# EAGLE design regler (EAGLE 7.5.0)
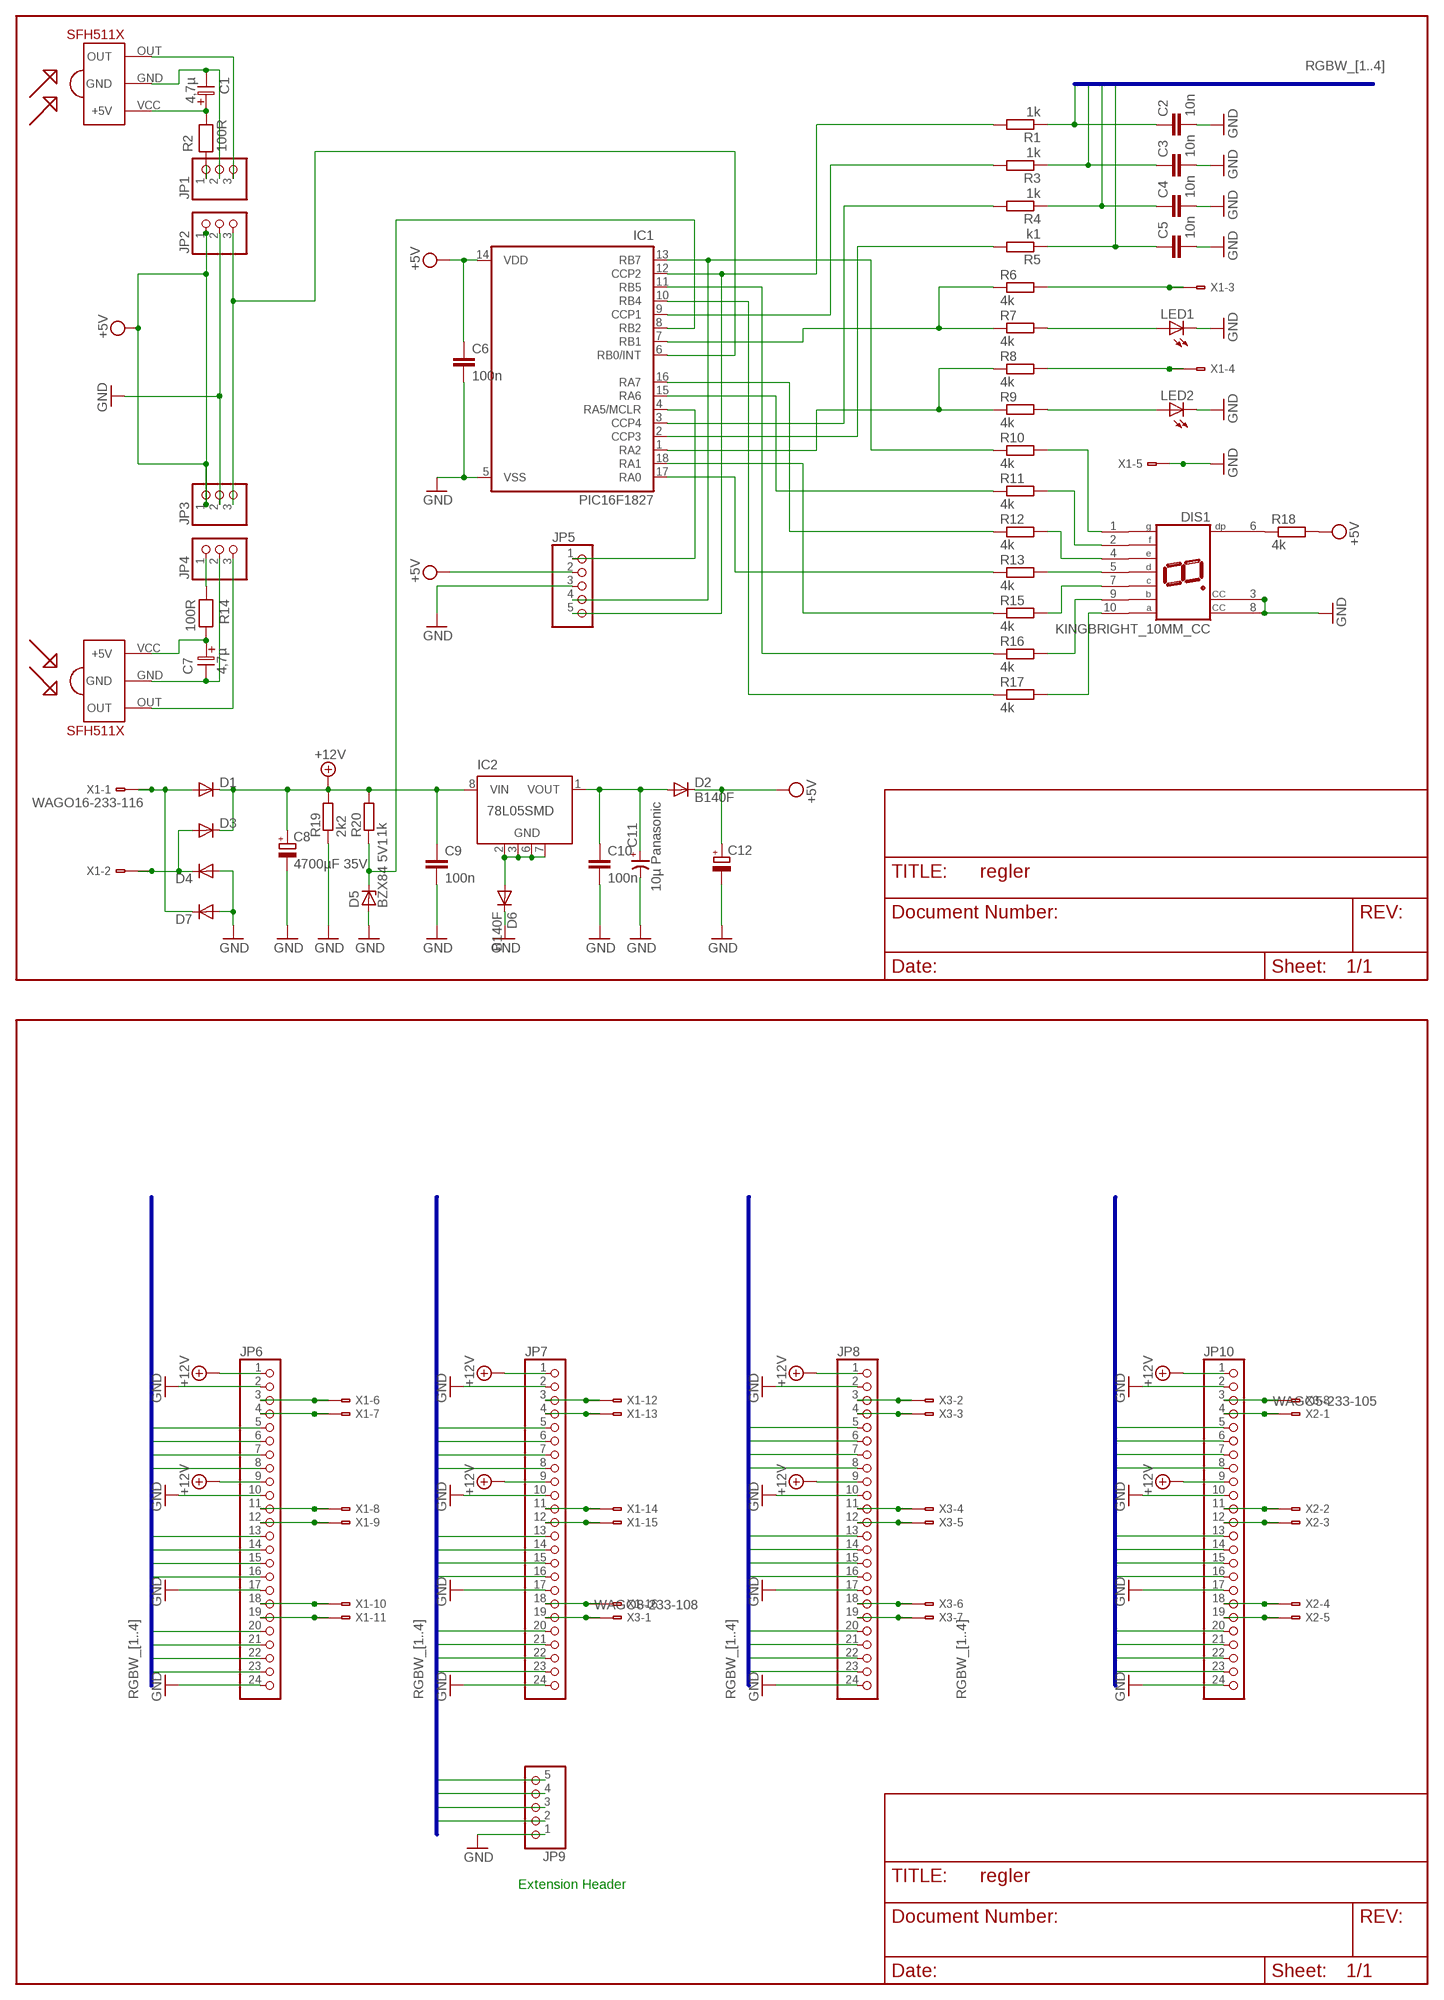
[diagram p0: schematic, sheet 1]

## Parts
C1  4,7µ  ELC-2,5  [ES-2,5]
C2  10n  C-EUC1206K  [C1206K]
C3  10n  C-EUC1206K  [C1206K]
C4  10n  C-EUC1206K  [C1206K]
C5  10n  C-EUC1206K  [C1206K]
C6  100n  C-EUC1206K  [C1206K]
C7  4,7µ  ELC-2,5  [ES-2,5]
C8  4700µF 35V  CPOL-EUE7.5-18  [E7,5-18]
C9  100n  C-EUC1206K  [C1206K]
C10  100n  C-EUC1206K  [C1206K]
C11  10µ Panasonic  CP-SV-B  [SV-B]
C12  CPOL-EUE5-5  [E5-5]
D1  DIODE-SMC  [SMC]
D2  B140F  DIODE-  [DO214AA]
D3  DIODE-SMC  [SMC]
D4  DIODE-SMC  [SMC]
D5  BZX84 5V1  BZX84CSMD  [TO236]
D6  B140F  DIODE-  [DO214AA]
D7  DIODE-SMC  [SMC]
DIS1  KINGBRIGHT_10MM_CC  [HDSP-E]
IC1  PIC16F1827  PIC16F1827_RGB_CONTROLLER7SO  [SO-18W]
IC2  78L05SMD  [SO08]
IR-RECEIVERS1  SFH511XB  [SFH5110]
IR-RECEIVERS2  SFH511XB  [SFH5110]
JP1  PINHD-1X3_2.54  [1X03]
JP2  PINHD-1X3_2.54-SMD  [1X03SMD]
JP3  PINHD-1X3_2.54-SMD  [1X03SMD]
JP4  PINHD-1X3_2.54  [1X03]
JP5  PINHD-1X5_2.54-SMD  [1X05SMD]
JP6  PINHD-1X24_2.54-SMD  [1X24SMD]
JP7  PINHD-1X24_2.54-SMD  [1X24SMD]
JP8  PINHD-1X24_2.54-SMD  [1X24SMD]
JP9  PINHD-1X5_2.54-SMD-90°  [1X05SMD/90]
JP10  PINHD-1X24_2.54-SMD  [1X24SMD]
LED1  LEDCHIPLED_1206  [CHIPLED_1206]
LED2  LEDCHIPLED_1206  [CHIPLED_1206]
R1  1k  R-EU_R1210W  [R1210W]
R2  100R  RESEU-10  [R-10]
R3  1k  R-EU_R1210W  [R1210W]
R4  1k  R-EU_R1210W  [R1210W]
R5  k1  R-EU_R1210W  [R1210W]
R6  4k  R-EU_R0805W  [R0805W]
R7  4k  R-EU_R0805W  [R0805W]
R8  4k  R-EU_R0805W  [R0805W]
R9  4k  R-EU_R0805W  [R0805W]
R10  4k  R-EU_R0805W  [R0805W]
R11  4k  R-EU_R0805W  [R0805W]
R12  4k  R-EU_R0805W  [R0805W]
R13  4k  R-EU_R0805W  [R0805W]
R14  100R  RESEU-10  [R-10]
R15  4k  R-EU_R0805W  [R0805W]
R16  4k  R-EU_R0805W  [R0805W]
R17  4k  R-EU_R0805W  [R0805W]
R18  4k  R-EU_R0805W  [R0805W]
R19  2k2  R-EU_R1210W  [R1210W]
R20  1k  R-EU_R1210W  [R1210W]
X1  WAGO16-233-116  [233-116]
X2  WAGO5-233-105  [233-105]
X3  WAGO8-233-108  [233-108]

## Nets
+12V: C8.+ C9.1 D1.C D3.C IC2.8(VIN) JP6.1 JP6.9 JP7.1 JP7.9 JP8.1 JP8.9 JP10.1 JP10.9 R19.2 R20.2
ABC: IC1.12(CCP2) JP5.5 R1.2
DEF: IC1.9(CCP1) R3.2
GHI: IC1.3(CCP4) R4.2
GND: C1.2 C2.2 C3.2 C4.2 C5.2 C6.2 C7.2 C8.- C9.2 C10.2 C11.- C12.- D4.A D5.A D6.C D7.A DIS1.3(CC) DIS1.8(CC) IC1.5(VSS) IR-RECEIVERS1.GND IR-RECEIVERS2.GND JP1.2 JP2.2 JP3.2 JP4.2 JP5.3 JP6.2 JP6.10 JP6.17 JP6.24 JP7.2 JP7.10 JP7.17 JP7.24 JP8.2 JP8.10 JP8.17 JP8.24 JP9.1 JP10.2 JP10.10 JP10.17 JP10.24 LED1.C LED2.C R19.1 X1.A5(-5:A1) X1.B5(-5:B1)
JKL: IC1.2(CCP3) R5.2
N$1: D1.A D7.C X1.A1(-1:A1) X1.B1(-1:B1)
N$2: D3.A D4.C X1.A2(-2:A1) X1.B2(-2:B1)
N$3: JP6.3 X1.A6(-6:A1) X1.B6(-6:B1)
N$4: D6.A IC2.2(GND) IC2.3(GND) IC2.6(GND) IC2.7(GND)
N$5: C10.1 C11.+ D2.A IC2.1(VOUT)
N$6: D5.C IC1.8(RB2) R20.1
N$7: JP6.4 X1.A7(-7:A1) X1.B7(-7:B1)
N$8: DIS1.6(DP) R18.1
N$9: IC1.17(RA0) R13.1
N$10: IC1.16(RA7) R12.1
N$11: IC1.15(RA6) R11.1
N$12: IC1.13(RB7) JP5.4 R10.1
N$13: IC1.10(RB4) R17.1
N$14: LED2.A R9.2
N$15: IC1.7(RB1) R6.1 R7.1
N$16: LED1.A R7.2
N$17: IC1.6(RB0/INT) JP2.3 JP3.3
N$18: R8.2 X1.A4(-4:A1) X1.B4(-4:B1)
N$19: R6.2 X1.A3(-3:A1) X1.B3(-3:B1)
N$20: C1.1 IR-RECEIVERS1.VCC(+5V) R2.2
N$21: JP1.1 R2.1
N$22: C7.1 IR-RECEIVERS2.VCC(+5V) R14.2
N$23: JP4.1 R14.1
N$24: DIS1.1(G) R10.2
N$25: DIS1.2(F) R11.2
N$26: DIS1.4(E) R12.2
N$27: DIS1.5(D) R13.2
N$28: DIS1.7(C) R15.2
N$29: DIS1.9(B) R16.2
N$30: DIS1.10(A) R17.2
N$31: JP10.3 X3.A8(-8:A1) X3.B8(-8:B1)
N$32: JP6.11 X1.A8(-8:A1) X1.B8(-8:B1)
N$33: JP6.12 X1.A9(-9:A1) X1.B9(-9:B1)
N$34: JP6.18 X1.A10(-10:A1) X1.B10(-10:B1)
N$35: JP6.19 X1.A11(-11:A1) X1.B11(-11:B1)
N$36: JP7.3 X1.A12(-12:A1) X1.B12(-12:B1)
N$37: JP7.4 X1.A13(-13:A1) X1.B13(-13:B1)
N$38: JP7.11 X1.A14(-14:A1) X1.B14(-14:B1)
N$39: JP7.12 X1.A15(-15:A1) X1.B15(-15:B1)
N$40: JP7.18 X1.A16(-16:A1) X1.B16(-16:B1)
N$41: JP7.19 X3.A1(-1:A1) X3.B1(-1:B1)
N$42: JP8.3 X3.A2(-2:A1) X3.B2(-2:B1)
N$43: JP8.4 X3.A3(-3:A1) X3.B3(-3:B1)
N$44: JP8.11 X3.A4(-4:A1) X3.B4(-4:B1)
N$45: JP8.12 X3.A5(-5:A1) X3.B5(-5:B1)
N$46: JP8.18 X3.A6(-6:A1) X3.B6(-6:B1)
N$47: JP8.19 X3.A7(-7:A1) X3.B7(-7:B1)
N$48: IC1.11(RB5) R16.1
N$49: JP10.4 X2.A1(-1:A1) X2.B1(-1:B1)
N$50: IC1.18(RA1) R15.1
N$51: JP10.11 X2.A2(-2:A1) X2.B2(-2:B1)
N$52: IC1.4(RA5/MCLR) JP5.1
N$53: JP10.12 X2.A3(-3:A1) X2.B3(-3:B1)
N$54: JP10.18 X2.A4(-4:A1) X2.B4(-4:B1)
N$55: JP10.19 X2.A5(-5:A1) X2.B5(-5:B1)
N$56: IC1.1(RA2) R8.1 R9.1
OUT: IR-RECEIVERS1.OUT IR-RECEIVERS2.OUT JP1.3 JP4.3
RGBW_1: C2.1 JP6.8 JP6.16 JP6.23 JP7.8 JP7.16 JP7.23 JP8.8 JP8.16 JP8.23 JP9.5 JP10.8 JP10.16 JP10.23 R1.1
RGBW_2: C5.1 JP6.7 JP6.15 JP6.22 JP7.7 JP7.15 JP7.22 JP8.7 JP8.15 JP8.22 JP9.4 JP10.7 JP10.15 JP10.22 R5.1
RGBW_3: C4.1 JP6.6 JP6.14 JP6.21 JP7.6 JP7.14 JP7.21 JP8.6 JP8.14 JP8.21 JP9.3 JP10.14 JP10.21 R4.1
RGBW_4: C3.1 JP6.5 JP6.13 JP6.20 JP7.5 JP7.13 JP7.20 JP8.5 JP8.13 JP8.20 JP9.2 JP10.5 JP10.13 JP10.20 R3.1
VDD: C6.1 C12.+ D2.C IC1.14(VDD) JP2.1 JP3.1 JP5.2 R18.2 ; supply symbol labelled +5V
Unconnected: IC2.4(NC) IC2.5(NC) JP10.6

## Buses
RGBW_[1..4]

## Notes on the sheet
- Extension Header

## Library data of the parts
C1 C7 = discrete:ELC-2,5
C2-C6 C9 C10 = rcl:C-EU: CAPACITOR, European symbol
C8 C12 = rcl:CPOL-EU: POLARIZED CAPACITOR, European symbol
C11 = cap-master:CP-: POLARIZED CAP
D1-D4 D6 D7 = diode:DIODE-: DIODE
D5 = diode:BZX84CSMD: Z DIODE
DIS1 = Martin:KINGBRIGHT_10MM_CC: LED DISPLAY 1-character 7 segment, decimal point right
IC1 = Martin:PIC16F1827_RGB_CONTROLLER: FLASH-Based 8-Bit CMOS Microcontroller Source: http://ww1.microchip.com/downloads/en/DeviceDoc/40300C.pdf
IC2 = linear:78L*SMD: Positive VOLTAGE REGULATOR
IR-RECEIVERS1 IR-RECEIVERS2 = sfh511x:SFH511X
JP1-JP4 = pinhead-1:PINHD-1X3: PIN HEADER
JP5 JP9 = pinhead-1:PINHD-1X5: PIN HEADER
JP6-JP8 JP10 = pinhead-1:PINHD-1X24: PIN HEADER
LED1 LED2 = led:LED: LED OSRAM: - CHIPLED LG R971, LG N971, LY N971, LG Q971, LY Q971, LO R971, LY R971 LH N974, LH R974 LS Q976, LO Q976, LY Q976 LO Q996 - Hyper CHIPLED LW Q18S LB Q993, LB Q99A, LB R99A - SideLED LS A670, LO A670, LY A670, LG A670, LP A670 LB A673, LV A673, LT A673, LW A673 LH A674 LY A675 LS A676, LA A676, LO A676, LY A676, LW A676 LS A679, LY A679, LG A679 - Hyper Micro SIDELED® LS Y876, LA Y876, LO Y876, LY Y876 LT Y87S - SmartLED LW L88C, LW L88S LB L89C, LB L89S, LG L890 LS L89K, LO L89K, LY L89K LS L896, LA L896, LO L896, LY L896 - TOPLED LS T670, LO T670, LY T670, LG T670, LP T670 LSG T670, LSP T670, LSY T670, LOP T670, LYG T670 LG T671, LOG T671, LSG T671 LB T673, LV T673, LT T673, LW T673 LH T674 LS T676, LA T676, LO T676, LY T676, LB T676, LH T676, LSB T676, LW T676 LB T67C, LV T67C, LT T67C, LS T67K, LO T67K, LY T67K, LW E67C LS E67B, LA E67B, LO E67B, LY E67B, LB E67C, LV E67C, LT E67C LW T67C LS T679, LY T679, LG T679 LS T770, LO T770, LY T770, LG T770, LP T770 LB T773, LV T773, LT T773, LW T773 LH T774 LS E675, LA E675, LY E675, LS T675 LS T776, LA T776, LO T776, LY T776, LB T776 LHGB T686 LT T68C, LB T68C - Hyper Mini TOPLED® LB M676 - Mini TOPLED Santana® LG M470 LS M47K, LO M47K, LY M47K Source: http://www.osram.convergy.de/
R1 R3-R13 R15-R20 = rcl:R-EU_: RESISTOR, European symbol
R2 R14 = discrete:RESEU-10
X1 = con-wago:WAGO16-: WAGO Cage Clamp
X2 = con-wago:WAGO5-: WAGO Cage Clamp
X3 = con-wago:WAGO8-: WAGO Cage Clamp

## Board
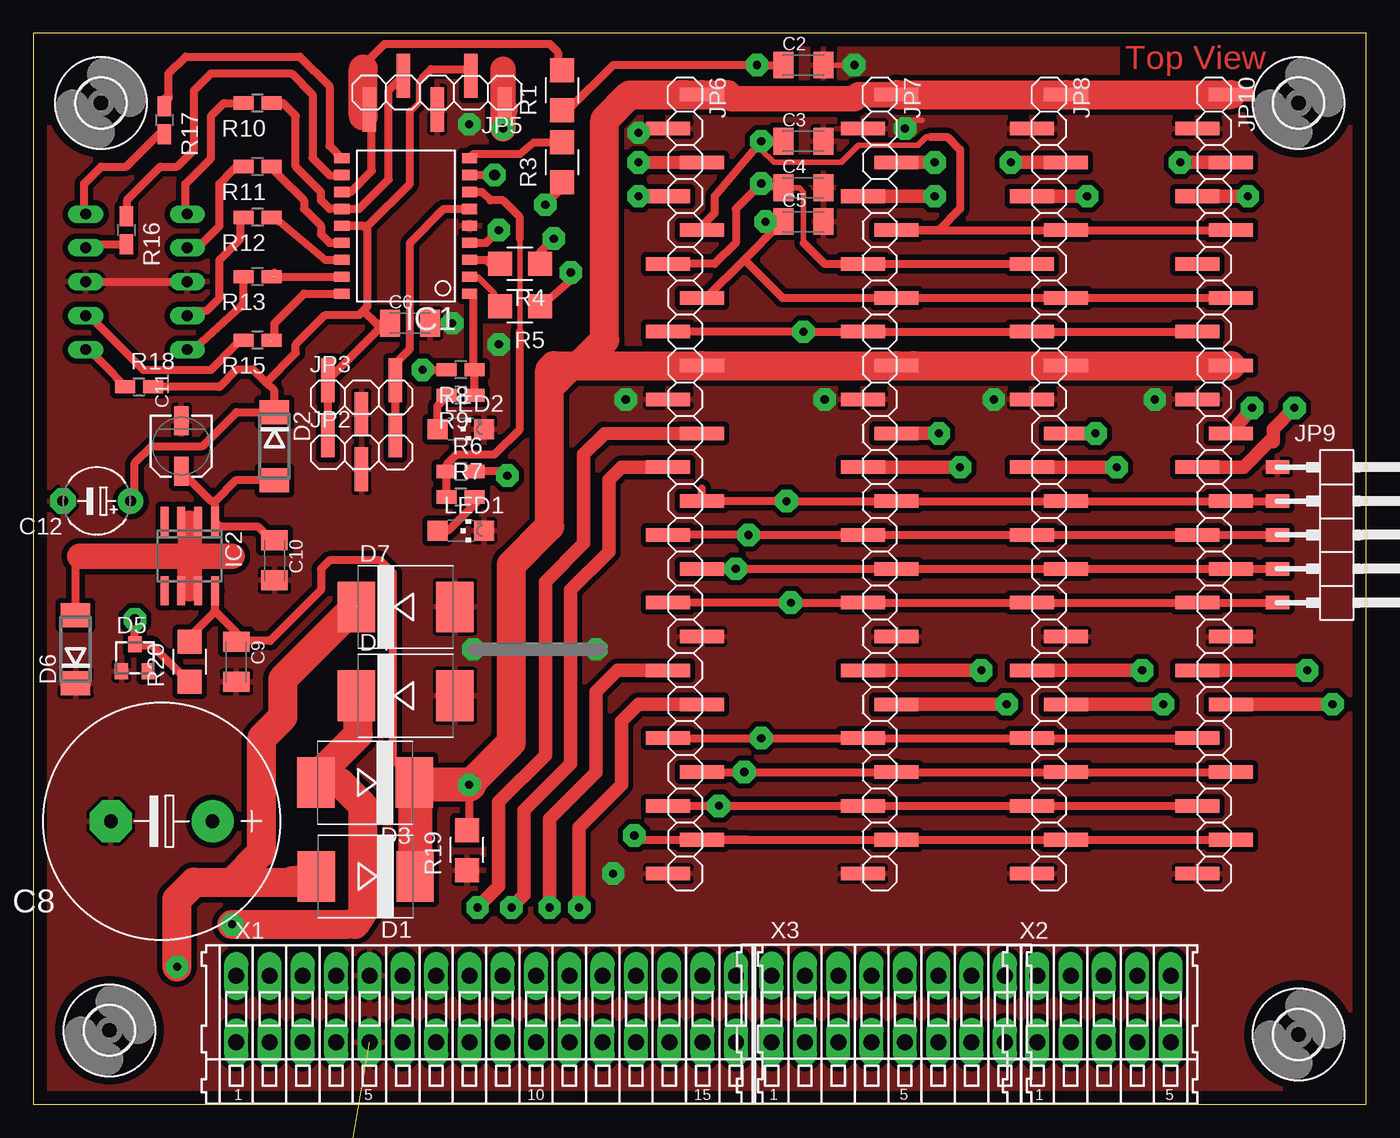
[diagram p1: board, top side]
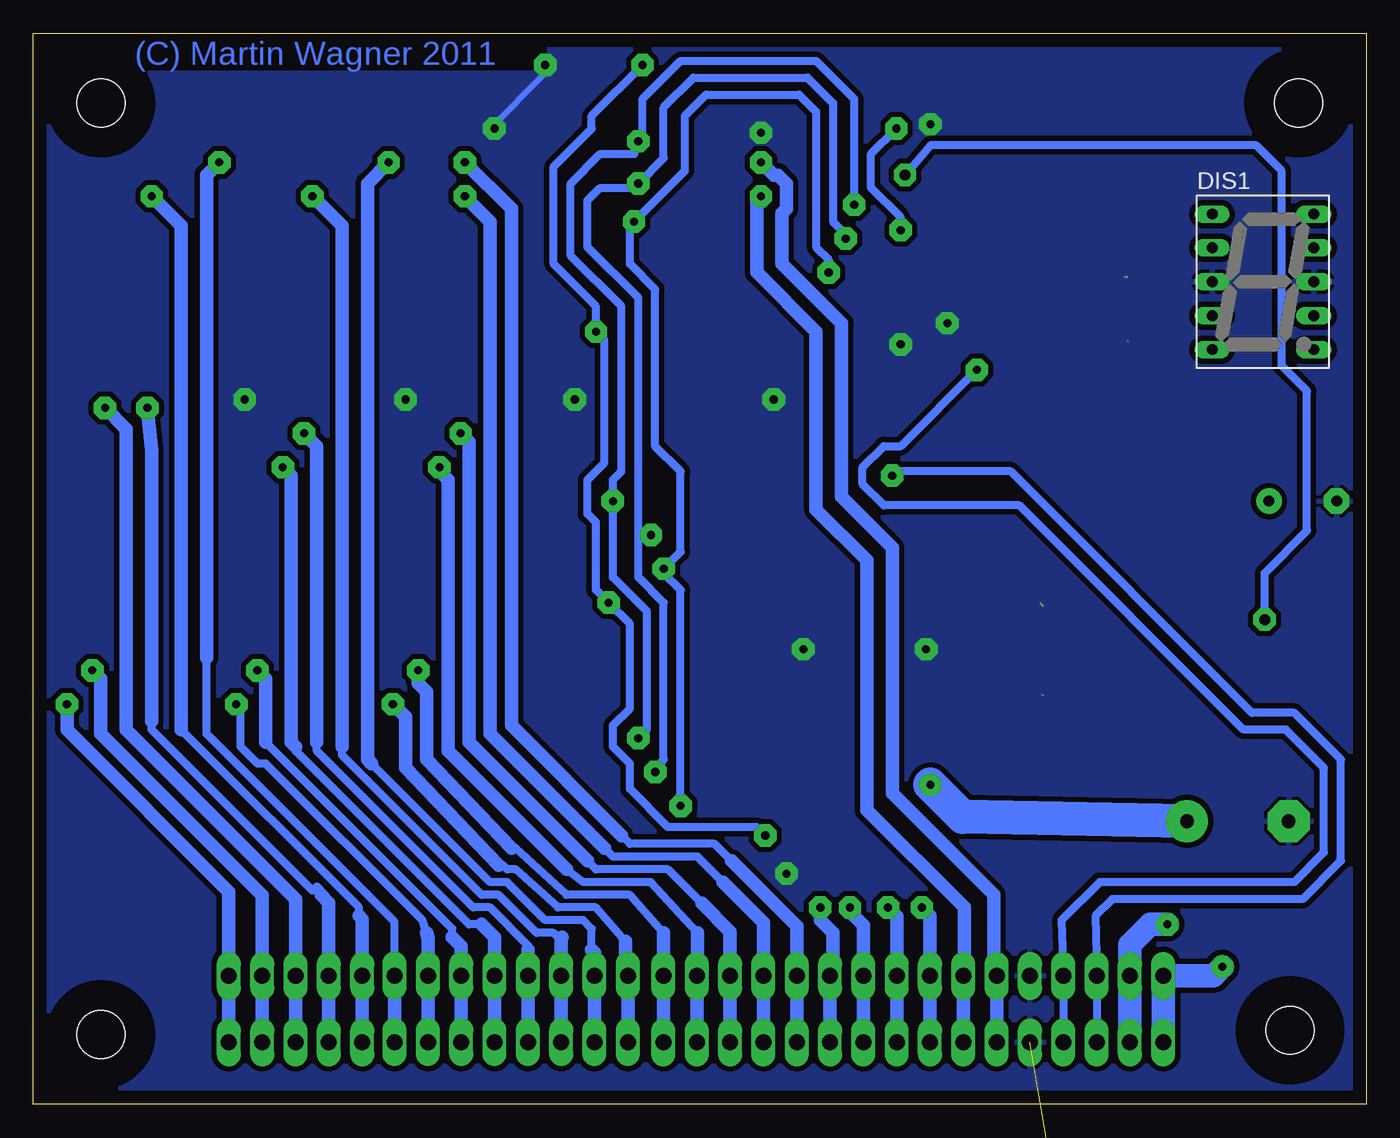
[diagram p2: board, bottom side, seen from below]

Size 99.99 x 80.31 mm. Coordinates in mm from the lower left corner, seen from the top.
Outline: 0,0 99.99,0 99.99,80.31 0,80.31 0,0
Copper layers (1*16): Top 0.035mm / dielectric 1.5mm / Bottom 0.035mm
Design rules "default": minimum track width 10mil, minimum drill 5mil, track to track 0.4mm, track to pad 0.4mm, pad to pad 0.3mm, via to via 0.3mm, smd to smd 8mil, copper to edge 40mil, drill to drill 8mil, minimum pad ring 10mil, minimum via ring 8mil, stop-mask expansion 4mil, vias tented up to drill 0mil, thermal gap 10mil

### Footprints (pad centres in the part's own frame; a part is rotated, then mirrored left to right if it is on the bottom)
ES-2,5 = drill 0.61 pad 1.27 octagon: 1 -1.27,0; 2 1.27,0
C1206K = smd 1.5 x 2: 1 -1.5,0; 2 1.5,0
E7,5-18 = drill 1.016 pad 3.15: + -3.81,0 | drill 1.016 pad 3.15 octagon: - 3.81,0
SV-B = smd 2.184 x 1.067: + -1.905,0; - 1.905,0
E5-5 = drill 0.813 pad 1.905: + -2.54,0 | drill 0.813 pad 1.905 octagon: - 2.54,0
SMC = smd 2.8 x 3.8: A 3.7,0; C -3.7,0
DO214AA = smd 1.8 x 2.2: A 2.55,0; C -2.55,0
TO236 = smd 1 x 1.2: A -1,-1; C 0,1; NC 1,-1
HDSP-E = drill 0.813 long: 1 -3.81,5.08; 2 -3.81,2.54; 3 -3.81,0; 4 -3.81,-2.54; 5 -3.81,-5.08; 6 3.81,-5.08; 7 3.81,-2.54; 8 3.81,0; 9 3.81,2.54; 10 3.81,5.08
SO-18W = smd 0.762 x 1.143: 1 -5.08,-4.788; 2 -3.81,-4.788; 3 -2.54,-4.788; 4 -1.27,-4.788; 5 0,-4.788; 6 1.27,-4.788; 7 2.54,-4.788; 8 3.81,-4.788; 9 5.08,-4.788; 10 5.08,4.788; 11 3.81,4.788; 12 2.54,4.788; 13 1.27,4.788; 14 0,4.788; 15 -1.27,4.788; 16 -2.54,4.788; 17 -3.81,4.788; 18 -5.08,4.788
SO08 = smd 0.6 x 2.2: 1 -1.905,-2.6; 2 -0.635,-2.6; 3 0.635,-2.6; 4 1.905,-2.6; 5 1.905,2.6; 6 0.635,2.6; 7 -0.635,2.6; 8 -1.905,2.6
SFH5110 = drill 0.5 pad 1.676: GND 0,2.54; OUT 0,5.08; VCC 0,0
1X03 = drill 1.016 long: 1 -2.54,0; 2 0,0; 3 2.54,0
1X03SMD = smd 1.016 x 3.302: 1 -1.27,1.27; 2 1.27,-1.27; 3 3.81,1.27
1X05SMD = smd 1.016 x 3.302: 1 -1.27,1.27; 2 1.27,-1.27; 3 3.81,1.27; 4 6.35,-1.27; 5 8.89,1.27
1X24SMD = smd 1.016 x 3.302: 1 -1.27,1.27; 2 1.27,-1.27; 3 3.81,1.27; 4 6.35,-1.27; 5 8.89,1.27; 6 11.43,-1.27; 7 13.97,1.27; 8 16.51,-1.27; 9 19.05,1.27; 10 21.59,-1.27; 11 24.13,1.27; 12 26.67,-1.27; 13 29.21,1.27; 14 31.75,-1.27; 15 34.29,1.27; 16 36.83,-1.27; 17 39.37,1.27; 18 41.91,-1.27; 19 44.45,1.27; 20 46.99,-1.27; 21 49.53,1.27; 22 52.07,-1.27; 23 54.61,1.27; 24 57.15,-1.27
1X05SMD/90 = smd 1.016 x 1.778: 1 -1.27,-5.08; 2 1.27,-5.08; 3 3.81,-5.08; 4 6.35,-5.08; 5 8.89,-5.08
CHIPLED_1206 = smd 1.5 x 1.5: A 0,-1.75; C 0,1.75
R1210W = smd 1.8 x 1.8: 1 -1.499,0; 2 1.499,0
R-10 = drill 0.813 pad 1.6 octagon: 1 -5.08,0; 2 5.08,0
R0805W = smd 1.5 x 1: 1 -1.052,0; 2 1.052,0
3,6 = hole 3.6: 0,0
233-116 = drill 1.2 long: A1 -18.75,2.5; A2 -16.25,2.5; A3 -13.75,2.5; A4 -11.25,2.5; A5 -8.75,2.5; A6 -6.25,2.5; A7 -3.75,2.5; A8 -1.25,2.5; A9 1.25,2.5; A10 3.75,2.5; A11 6.25,2.5; A12 8.75,2.5; A13 11.25,2.5; A14 13.75,2.5; A15 16.25,2.5; A16 18.75,2.5; B1 -18.75,-2.5; B2 -16.25,-2.5; B3 -13.75,-2.5; B4 -11.25,-2.5; B5 -8.75,-2.5; B6 -6.25,-2.5; B7 -3.75,-2.5; B8 -1.25,-2.5; B9 1.25,-2.5; B10 3.75,-2.5; B11 6.25,-2.5; B12 8.75,-2.5; B13 11.25,-2.5; B14 13.75,-2.5; B15 16.25,-2.5; B16 18.75,-2.5
233-105 = drill 1.2 long: A1 -5,2.5; A2 -2.5,2.5; A3 0,2.5; A4 2.5,2.5; A5 5,2.5; B1 -5,-2.5; B2 -2.5,-2.5; B3 0,-2.5; B4 2.5,-2.5; B5 5,-2.5
233-108 = drill 1.2 long: A1 -8.75,2.5; A2 -6.25,2.5; A3 -3.75,2.5; A4 -1.25,2.5; A5 1.25,2.5; A6 3.75,2.5; A7 6.25,2.5; A8 8.75,2.5; B1 -8.75,-2.5; B2 -6.25,-2.5; B3 -3.75,-2.5; B4 -1.25,-2.5; B5 1.25,-2.5; B6 3.75,-2.5; B7 6.25,-2.5; B8 8.75,-2.5

### Placement (x,y rotation side)
C1  49.33,-10.12 90 top  (outside the outline)
C2  57.78,77.94 0 top
C3  57.78,72.22 0 top
C4  57.78,68.73 0 top
C5  57.78,66.19 0 top
C6  28.25,58.57 0 top
C7  54.41,-10.44 90 top  (outside the outline)
C8  9.63,21.23 180 top
C9  15.24,33.17 270 top
C10  18.09,40.79 270 top
C11  11.11,49.37 90 top
C12  4.76,45.24 180 top
D1  24.94,17.08 180 top
D2  18.09,49.37 270 top
D3  24.9,24.12 180 top
D4  27.93,30.63 0 top
D5  7.62,33.49 0 top
D6  3.17,34.12 90 top
D7  27.93,37.3 0 top
DIS1  7.74,61.68 0 bottom
IC1  27.93,65.88 90 top
IC2  11.74,41.11 180 top
IR-RECEIVERS1  76,-13.61 90 top  (outside the outline)
IR-RECEIVERS2  64.57,-13.61 90 top  (outside the outline)
JP1  28.69,-11.07 90 top  (outside the outline)
JP2  23.35,48.89 0 top
JP3  23.35,53.02 0 top
JP4  22.66,-10.44 90 top  (outside the outline)
JP5  34.1,75.87 180 top
JP6  48.89,74.45 270 top
JP7  63.5,74.45 270 top
JP8  76.19,74.45 270 top
JP9  98.42,46.51 270 top
JP10  88.58,74.45 270 top
LED1  32.06,43.02 270 top
LED2  32.06,50.63 270 top
R1  39.68,76.03 90 top
R2  44.25,-11.39 90 top  (outside the outline)
R3  39.68,70.64 90 top
R4  36.51,63.02 180 top
R5  36.51,59.84 180 top
R6  32.06,47.46 0 top
R7  32.06,45.55 0 top
R8  32.06,55.08 180 top
R9  32.06,53.17 180 top
R10  16.82,75.08 180 top
R11  16.82,70.32 180 top
R12  16.82,66.51 180 top
R13  16.82,62.06 180 top
R14  37.26,-10.75 90 top  (outside the outline)
R15  16.82,57.3 180 top
R16  6.98,65.56 270 top
R17  9.84,73.81 270 top
R18  7.93,53.81 0 top
R19  32.53,19.07 90 top
R20  11.74,33.17 90 top
U$1  [3,6]  94.93,75.08 0 top
U$2  [3,6]  94.93,5.23 0 top
U$3  [3,6]  5.71,5.55 0 top
U$4  [3,6]  5.08,75.08 0 top
X1  33.97,7.14 0 top
X2  80.32,7.14 0 top
X3  64.14,7.16 0 top

### Tracks (layer width: path | path; a pad name or v marks a point on that pad's centre or on a via)
+12V  (via drill 0.61 pad 1.68)
  Top 0.61: R20.2 11.74,35.08 13.65,36.98 | 13.65,36.98 IC2.8 | 13.65,36.98 15.24,35.39 C9.1 15.32,34.76 17.77,34.76 21.58,38.57 21.58,40.16 22.22,40.79 26.03,40.79 26.98,39.84 26.98,25.87 28.57,24.28 28.57,24.15 D3.C | R19.2 32.54,20.63 32.7,20.79 v32.7,23.96 | 48.57,75.71 48.57,75.72
  Top 1.93: JP7.1 61.91,75.72 61.59,75.4 52.38,75.4 52.07,75.72
  Top 2.184: 48.89,75.71 48.57,75.71 44.75,75.7 42.86,73.81 42.86,57.3 40.95,55.4 39.05,55.4 38.73,55.08 38.73,53.81 | 48.89,75.71 JP6.1 | 38.73,53.81 38.73,43.33 35.87,40.48 35.87,27.14 v32.7,23.96 | 38.73,53.81 40.3,55.38 JP6.9 JP7.9 | 48.89,75.71 48.89,75.72 52.07,75.72 | JP8.1 78.73,75.72 | JP8.1 JP10.1 | JP7.1 JP8.1 | JP7.9 66.03,55.4 | JP7.9 JP8.9 JP10.9
  Top 2.54: v32.7,23.96 28.89,23.96 28.57,24.28 28.64,24.22 D1.C
  Bottom 2.54: C8.+ 30.28,21.54 v32.7,23.96
ABC
  Top 0.61: IC1.12 23.81,68.41 25.39,70 25.39,74.13 | JP5.5 25.21,74.58 25.08,74.45 25.39,74.13 | 25.39,74.13 24.76,74.13 | 24.76,77.62 24.76,77.94 26.35,79.53 38.73,79.53 39.37,78.89 39.37,77.94 39.68,77.62 R1.2
  Top 2.184: 24.76,74.13 24.76,77.62
DEF
  Top 0.61: R3.2 37.55,72.14 36.51,71.27 33.02,71.27 32.7,70.95 IC1.9
GHI
  Top 0.61: R4.2 34.6,62.7 33.97,63.34 IC1.3 32.7,63.34
GND  (via drill 0.61 pad 1.68)  (6 unrouted)
  Top 0.406: C4.2 59.37,68.73 | C5.2 59.37,66.19 | 66.67,73.81 65.4,73.81 v65.4,73.18 | C2.2 v61.59,77.94
  Top 0.61: DIS1.8 3.87,61.68 | 3.87,61.68 DIS1.3 | 3.87,61.68 3.8,61.75
  Bottom 0.406: v61.59,77.94 61.59,77.3 65.72,73.18 v65.4,73.18
  other vias: 33.02,34.12 31.43,58.57 42.22,34.12 32.7,73.5 44.45,52.86 45.4,72.86 43.49,17.3 59.37,52.86 72.07,52.86 84.13,52.86 34.92,56.98
  pour Bottom: 0.63,80.16 99.69,80.16 99.69,0.47 0.63,0.47
  pour Top: 0.63,80.16 99.69,80.16 99.69,0.47 0.63,0.47
JKL
  Top 0.406: IC1.2 33.33,62.06 34.6,60.8 34.6,60.16 34.92,59.84 R5.2
N$1  (via drill 0.61 pad 1.68)  (1 unrouted)
  Top 2.184: v10.79,10.31 10.79,15.39 12.06,16.66 14.92,16.66 | 14.92,16.66 20,16.66 | 20,16.66 20.95,16.98 21.05,17.08 D1.A 19.47,16.77 20,16.66 | 24.37,37.69 24.44,37.62 18.73,31.9 18.73,29.04 17.14,27.46 17.14,18.88 14.92,16.66
  Bottom 1.778: X1.B1 X1.A1 | X1.A1 15.22,9.66 15.24,9.68 | X1.A1 11.47,9.64 v10.79,10.31
N$2  (via drill 0.61 pad 1.68)  (1 unrouted)
  Top 1.778: 23.49,13.49 24.12,13.49
  Top 2.184: 24.37,30.7 24.44,30.63 24.37,30.56 24.37,27.7 20.95,24.28 21.11,24.12 D3.A 23.02,24.12 24.76,22.38 24.76,14.44 24.12,13.49 | v14.92,13.49 23.49,13.49
  Bottom 1.778: 17.73,9.64 17.77,9.68 | 17.73,9.64 X1.A2 17.72,11.96 16.19,13.49 v14.92,13.49 | X1.B2 17.72,9.62 17.73,9.64
N$3  (via drill 0.61 pad 1.68)
  Top 1.016: JP6.3 45.41,70.62 v45.4,70.64
  Bottom 1.016: v45.4,70.64 44.45,69.69 44.13,69.69 43.49,69.05 43.49,67.14 43.81,66.83 43.81,63.02 39.37,58.57 39.37,45.55 35.55,41.74 35.55,23.33 27.93,15.71 27.93,10 27.62,9.68 27.66,9.64 X1.A6 27.72,4.38 | X1.B6 27.72,4.38 | 27.72,4.38 27.62,4.28
N$4
  Top 0.61: IC2.3 12.32,43.71 12.38,43.65 IC2.2 12.38,41.11 IC2.7 11.8,38.51 11.74,38.57 | 11.74,38.89 11.43,38.89 11.11,38.57 IC2.6 11.11,40.48 3.17,40.48 D6.A
  Top 1.778: 11.74,43.65 11.74,38.89 11.74,38.57
  Top 1.93: 3.49,41.11 12.38,41.11 14.92,41.11
N$5
  Top 0.61: 13.65,45.24 IC2.1 13.65,43.65 13.97,43.33 16.82,43.33 17.86,42.29 C10.1 | 13.65,45.24 15.24,46.82 D2.A | 13.65,45.24 13.33,45.24 C11.+
N$6  (via drill 0.81 pad 1.68)
  Top 0.61: D5.C 7.62,34.44 | R20.1 11.65,31.67 8.89,34.44 7.62,34.44 | 7.62,34.44 v7.62,36.35 | 32.7,69.69 IC1.8 v34.6,69.69
  Bottom 0.61: v7.62,36.35 7.62,39.84 4.44,43.02 4.44,53.49 6.34,55.4 6.34,70 8.25,71.91 32.7,71.91 v34.6,69.69
N$7  (via drill 0.61 pad 1.68)
  Top 1.016: JP6.4 46.02,68.08 v45.4,68.1
  Bottom 1.016: v45.4,68.1 45.72,67.78 45.72,62.38 41.27,57.94 41.27,44.6 37.46,40.79 37.46,22.06 30.16,14.76 30.16,9.68 30.2,9.64 X1.A7 30.22,4.85 30.43,4.64 | 30.43,4.64 30.47,4.6 | X1.B7 30.43,4.64
N$8
  Top 0.61: DIS1.6 4.06,56.6 4.12,56.67 5.93,54.86 R18.1
N$9  (1 unrouted)
  Top 0.61: 23.17,62.06 IC1.17 18.09,62.06 18.09,62.38
N$10
  Top 0.61: 18.44,66.22 21.9,63.34 IC1.16 23.17,63.34 | 18.09,66.51 18.44,66.22 | 18.44,66.22 18.41,66.19 18.09,66.51 | R12.1 18.09,66.51
N$11
  Top 0.61: 18.41,69.69 20.31,67.78 20.31,67.14 21.58,65.88 21.58,65.24 22.22,64.61 IC1.15 23.17,64.61 | 18.41,69.69 18,70.09 | R11.1 17.88,70.22 18.41,69.69
N$12
  Top 0.61: JP5.4 26.66,76.05 26.66,69.37 24.44,67.14 IC1.13 22.22,67.14 21.58,67.78 21.58,68.41 19.68,70.32 19.68,74.13 19.36,74.45 18.73,75.08 R10.1
N$13
  Top 0.61: IC1.10 22.22,71.88 22.22,76.35 20,78.58 11.43,78.58 10.16,77.3 10.16,75.72 | 10.16,75.72 10.16,75.4 | R17.1 9.84,75.4 10.16,75.72
N$14
  Top 0.61: R9.2 31.11,53.17 30.31,52.38 LED2.A
N$15
  Top 0.406: 36.51,57.94 36.51,64.92
  Top 0.61: R7.1 31.11,45.55 31.01,45.66 R6.1 31.01,47.99 31.74,48.73 34.6,48.73 36.51,50.63 36.51,57.94 | 32.7,68.41 IC1.7 33.65,68.41 34.29,67.78 35.24,67.78 36.51,66.51 36.51,64.92
N$16
  Top 0.61: R7.2 33.12,45.45 33.33,45.24 31.11,43.02 LED1.A
N$17
  Top 0.61: 27.14,50.16 26.98,50 | JP2.3 27.14,50.16 | 27.14,50.16 27.16,50.18 JP3.3 27.16,55.58 28.25,56.67 28.25,64.61 30.79,67.14 IC1.6
N$18  (via drill 0.61 pad 1.68)
  Top 0.61: v29.2,55.08 R8.2
  Bottom 0.61: v29.2,55.08 34.92,49.37 36.19,49.37 37.78,47.78 37.78,46.51 36.19,44.92 26.03,44.92 9.2,28.09 6.03,28.09 3.17,25.23 3.17,18.88 5.39,16.66 20,16.66 22.86,13.81 X1.A4 22.81,9.64 | 22.81,9.64 22.86,9.68 | X1.B4 22.72,9.54 22.81,9.64
N$19  (via drill 0.61 pad 1.68)
  Top 0.61: 33.02,47.46 R6.2 35.24,47.46 v35.55,47.14
  Bottom 0.61: v35.55,47.14 35.24,47.46 26.66,47.46 8.57,29.36 5.39,29.36 1.9,25.87 1.9,18.25 4.76,15.39 19.04,15.39 20.31,14.12 X1.A3 20.27,9.64 | 20.27,9.64 20.31,9.68 | X1.B3 20.22,9.58 20.27,9.64
N$20  (2 unrouted)
N$21  (1 unrouted)
N$22  (2 unrouted)
N$23  (1 unrouted)
N$24
  Top 0.61: DIS1.1 11.55,66.64 11.43,66.51 11.43,69.05 13.33,70.95 13.33,74.13 14.28,75.08 R10.2
N$25
  Top 0.61: 14.92,70 13.97,69.05 13.97,65.88 12.7,64.61 12.06,64.61 11.55,64.1 | 14.92,70 15.32,70.41 | 11.55,64.1 11.43,63.97 | DIS1.2 11.55,64.1 | R11.2 15.24,70.32 14.92,70
N$26
  Top 0.61: DIS1.4 11.68,59.14 12.06,59.52 13.01,59.52 13.97,60.48 13.97,63.34 15.32,64.69 15.55,64.92 15.55,66.51 R12.2
N$27
  Top 0.61: DIS1.5 11.55,56.54 11.74,56.35 15.55,59.85 | 15.55,59.85 15.64,59.93 | 15.55,59.85 15.55,59.84 15.77,60.06 R13.2 | 15.55,59.85
N$28
  Top 0.61: 15.24,56.98 13.33,55.08 8.25,55.08 4.12,59.21 4.06,59.14 DIS1.7 | 15.24,56.98 15.49,57.24 | R15.2 15.55,57.3 15.24,56.98
N$29
  Top 0.61: 3.93,64.1 3.8,63.97 | DIS1.9 3.93,64.1 | 3.93,64.1 4.12,64.29 | 4.12,64.29 4.27,64.44 | R16.2 4.34,64.5 4.12,64.29
N$30
  Top 0.61: 9.2,72.54 6.98,70.32 5.08,70.32 3.8,69.05 3.8,66.51 3.93,66.64 DIS1.10 | 9.2,72.54 9.23,72.57 | R17.2 9.42,72.76 9.2,72.54
N$31  (via drill 0.61 pad 1.68)
  Top 1.016: v86.04,70.64 JP10.3
  Bottom 0.61: X3.A8 72.89,13.68 86.99,27.77 86.99,33.49
  Bottom 1.016: 73,9.66 73.02,9.68 | 73,9.66 X3.A8 | X3.B8 72.89,9.55 73,9.66 | 86.99,33.49 86.99,69.69 v86.04,70.64
N$32  (via drill 0.61 pad 1.68)
  Top 1.016: JP6.11 42.84,50.3 41.27,48.73 41.27,42.06 38.41,39.2 38.41,26.19 34.92,22.7 34.92,16.34 v33.33,14.76
  Bottom 1.016: X1.B8 X1.A8 | X1.A8 32.72,9.66 32.7,9.68 | X1.A8 32.72,14.14 v33.33,14.76
N$33  (via drill 0.61 pad 1.68)
  Top 1.016: JP6.12 44.11,47.76 43.18,46.82 43.18,41.43 40.32,38.57 40.32,25.55 36.83,22.06 36.83,15.71 v35.87,14.76
  Bottom 1.016: X1.B9 35.22,9.34 35.24,9.36 35.22,9.38 X1.A9 35.22,14.1 v35.87,14.76
N$34  (via drill 0.61 pad 1.68)
  Top 1.016: v38.73,14.76 38.73,21.42 42.22,24.92 42.22,30.95 43.81,32.54 47.3,32.54 47.32,32.52 JP6.18
  Bottom 1.016: 37.74,9.64 37.78,9.68 | 37.74,9.64 X1.A10 37.72,13.43 38.73,14.44 v38.73,14.76 | X1.B10 37.72,9.62 37.74,9.64
N$35  (via drill 0.61 pad 1.68)
  Top 1.016: v40.95,14.76 40.95,20.79 44.13,23.96 44.13,28.73 45.4,30 JP6.19
  Bottom 1.016: v40.95,14.76 40.95,13.81 40,12.85 40,10.31 40.64,9.68 40.6,9.64 X1.A11 40.22,4.7 40.28,4.64 | 40.28,4.64 40.32,4.6 | X1.B11 40.28,4.64
N$36  (via drill 0.61 pad 1.68)
  Top 1.016: v67.62,70.64 JP7.3
  Bottom 0.61: 47.62,18.25 48.89,19.52 55.24,19.52 55.88,20.15
  Bottom 1.016: 42.82,9.64 42.86,9.68 | 42.82,9.64 X1.A12 42.72,13.35 47.62,18.25 | X1.B12 42.72,9.54 42.82,9.64 | v67.62,70.64 64.13,67.14 64.13,28.41 55.88,20.15
N$37  (via drill 0.61 pad 1.68)
  Top 1.016: v67.62,68.1 JP7.4
  Bottom 0.61: 57.15,19.2 56.51,18.57 50.16,18.57 48.26,16.66
  Bottom 1.016: 45.12,9.64 45.08,9.68 | 45.12,9.64 X1.A13 45.22,13.62 48.26,16.66 | X1.B13 45.22,9.54 45.12,9.64 | 57.15,19.2 65.72,27.77 65.72,66.19 v67.62,68.1
N$38  (via drill 0.61 pad 1.68)
  Top 1.016: v67.94,50.32 JP7.11
  Bottom 0.61: 58.41,18.25 57.78,17.61 52.38,17.61 49.84,15.08
  Bottom 1.016: X1.B14 X1.A14 | X1.A14 47.72,9.78 47.94,10 | X1.A14 47.72,12.95 49.84,15.08 | 58.41,18.25 67.3,27.14 67.3,49.68 v67.94,50.32
N$39  (via drill 0.61 pad 1.68)
  Top 1.016: v69.53,47.78 JP7.12
  Bottom 0.61: 60,17.61 58.73,16.66 53.65,16.66 50.16,12.85
  Bottom 1.016: v69.53,47.78 69.53,47.46 68.89,46.82 68.89,26.5 60,17.61 | 50.16,12.85 50.16,9.68 50.2,9.64 X1.A15 50.22,4.97 50.16,4.92 50.22,4.86 X1.B15
N$40  (via drill 0.61 pad 1.68)
  Top 1.016: v71.11,32.54 JP7.18
  Bottom 0.61: 52.7,12.85 55.24,15.71 60,15.71 63.81,19.2 64.13,19.2
  Bottom 1.016: v71.11,32.54 71.11,31.58 70.48,30.95 70.48,25.87 64.13,19.2 | 52.7,12.85 52.7,9.68 52.72,9.66 X1.A16 52.72,4.61 | X1.B16 52.72,4.61 | 52.72,4.61 52.7,4.6
N$41  (via drill 0.61 pad 1.68)
  Top 1.016: v73.02,30 JP7.19
  Bottom 0.61: 65.08,17.93 64.77,17.93 64.45,17.61 63.81,17.61 60.64,14.76 57.78,14.76 55.56,12.22
  Bottom 1.016: v73.02,30 72.07,29.04 72.07,25.23 65.08,17.93 | 55.56,12.22 55.56,10 55.24,9.68 55.26,9.66 X3.A1 55.39,4.75 55.3,4.66 | 55.3,4.66 55.24,4.6 | X3.B1 55.3,4.66
N$42  (via drill 0.61 pad 1.68)
  Top 1.016: v73.34,70.64 JP8.3
  Bottom 0.61: 58.1,11.58 58.1,13.17 58.73,13.81 61.59,13.81 64.45,16.66 65.72,16.66 74.61,25.55
  Bottom 1.016: 58.08,9.66 58.1,9.68 | 58.08,9.66 X3.A2 57.89,11.38 58.1,11.58 | X3.B2 57.89,9.47 58.08,9.66 | 74.61,25.55 74.92,25.87 74.92,69.05 v73.34,70.64
N$43  (via drill 0.61 pad 1.68)
  Top 1.016: v79.05,68.1 JP8.4
  Bottom 0.61: 60.32,12.54 60.64,12.54 60.96,12.85 62.23,12.85 65.08,15.71 66.35,15.71 76.83,26.19 76.83,26.82
  Bottom 1.016: 60.62,9.66 60.64,9.68 | 60.62,9.66 X3.A3 60.39,12.46 60.32,12.54 | X3.B3 60.39,9.43 60.62,9.66 | v79.05,68.1 76.83,65.88 76.83,26.82
N$44  (via drill 0.61 pad 1.68)
  Top 1.016: v79.69,50.32 JP8.11
  Bottom 0.61: 62.86,11.58 62.86,11.9 65.72,14.76 66.99,14.76 78.73,26.5 78.73,27.14
  Bottom 1.016: X3.A4 62.86,9.68 | X3.A4 62.89,11.55 62.86,11.58 | X3.B4 62.89,9.65 X3.A4 | 78.73,27.14 78.73,49.37 v79.69,50.32
N$45  (via drill 0.61 pad 1.68)
  Top 1.016: v81.27,47.78 JP8.12
  Bottom 0.61: 66.35,13.49 67.3,13.49 80.32,26.5 80.32,26.82
  Bottom 1.016: X3.B5 X3.A5 | X3.A5 65.4,9.68 | X3.A5 65.39,12.53 66.35,13.49 | 80.32,26.82 80.64,27.14 80.64,47.14 v81.27,47.78
N$46  (via drill 0.61 pad 1.68)
  Top 1.016: v83.18,32.54 JP8.18
  Bottom 0.61: 68.57,12.54 68.57,13.17 82.55,27.14
  Bottom 1.016: 67.92,9.66 67.94,9.68 | 67.92,9.66 X3.A6 67.89,11.85 68.57,12.54 | X3.B6 67.89,9.63 67.92,9.66 | 82.55,27.14 82.55,31.9 v83.18,32.54
N$47  (via drill 0.61 pad 1.68)
  Top 1.016: v84.77,30 JP8.19
  Bottom 0.61: 70.48,12.85 70.8,13.81 82.55,25.55 83.18,25.55 84.45,26.82 84.45,29.68 v84.77,30
  Bottom 1.016: X3.B7 X3.A7 | X3.A7 70.39,9.91 70.48,10 | X3.A7 70.39,12.45 70.48,12.85
N$48
  Top 0.61: 23.17,69.69 IC1.11 22.22,69.69 20.95,70.95 20.95,75.72 19.36,77.3 13.33,77.3 12.06,76.03 12.06,71.59 10.79,70.32 9.52,70.32 7.04,67.84 7.04,66.89 6.98,66.83 R16.1
N$49  (via drill 0.61 pad 1.68)
  Top 1.016: v91.12,68.1 JP10.4
  Bottom 0.61: 75.56,14.12 75.56,14.76 88.89,28.09
  Bottom 1.016: 75.52,9.64 75.56,9.68 | 75.52,9.64 X2.A1 75.32,13.88 75.56,14.12 | X2.B1 75.32,9.44 75.52,9.64 | 88.89,28.09 88.89,65.88 v91.12,68.1
N$50  (1 unrouted)
  Top 0.61: IC1.18 20.31,60.8 18.09,58.57 18.09,57.62 17.77,57.3 17.84,57.24
N$51  (via drill 0.61 pad 1.68)
  Top 1.016: v91.44,52.22 JP10.11
  Bottom 0.61: 78.42,15.71 78.42,16.03 78.73,16.34 79.05,16.03 91.12,28.09 91.12,28.73
  Bottom 1.016: X2.B2 X2.A2 | X2.A2 77.78,9.68 | X2.A2 77.82,15.12 78.42,15.71 | 91.12,28.73 91.12,49.05 v91.44,52.22
N$52  (via drill 0.61 pad 1.68)
  Top 0.61: 32.7,64.61 IC1.4 33.97,64.61 v34.92,65.56
  Top 1.93: v35.24,73.18 35.24,74.77 | 35.24,74.77 35.38,74.63 JP5.1 | 35.24,74.77 35.24,77.62
  Bottom 0.61: v34.92,65.56 34.92,66.51 37.14,68.73 37.14,71.27 v35.24,73.18
N$53  (via drill 0.61 pad 1.68)
  Top 1.016: v94.61,52.22 93.02,50.63 93.02,49.68 92.7,49.68 90.8,47.78 JP10.12
  Bottom 1.016: X2.A3 80.32,9.68 | X2.B3 X2.A3 | X2.A3 80.32,15.39 93.02,28.09 93.02,50.63 v94.61,52.22
N$54  (via drill 0.61 pad 1.68)
  Top 1.016: v95.56,32.54 JP10.18
  Bottom 1.016: X2.B4 X2.A4 | X2.A4 82.86,9.68 | X2.A4 82.82,15.67 94.93,27.77 94.93,31.9 v95.56,32.54
N$55  (via drill 0.61 pad 1.68)
  Top 1.016: v97.47,30 JP10.19
  Bottom 1.016: 85.36,9.64 85.4,9.68 | 85.36,9.64 X2.A5 85.32,15.95 97.47,28.09 v97.47,30 | X2.B5 85.32,9.6 85.36,9.64
N$56
  Top 0.61: 33.02,55.08 R8.1 | R9.1 33.12,54.98 33.02,55.08 | R8.1 33.33,55.08 | 33.02,55.08 R8.1 | IC1.1 32.7,60.8 33.02,60.48 33.02,55.08
OUT  (3 unrouted)
RGBW_1  (via drill 0.61 pad 1.68)
  Top 0.61: R1.1 40.09,74.54 43.49,77.94 v54.29,77.94 C2.1 | JP6.8 v57.78,57.94 JP7.8 JP8.8 JP10.8 | JP6.16 v56.83,37.62 JP7.16 JP8.16 JP10.16 JP9.5 | 53.65,19.84 JP6.23 | 53.65,19.84 54.29,19.84 | JP8.23 JP10.23 | JP8.23 76.83,19.84 | JP8.23 JP7.23 53.65,19.84 | 53.65,19.84 45.4,19.84 v45.08,20.15
  Bottom 0.61: v54.29,77.94 58.1,74.13 58.1,73.18 60.96,70.32 60.96,63.02 57.78,59.84 v57.78,57.94 57.15,57.3 57.15,48.09 58.41,46.82 58.41,44.28 57.78,43.65 57.78,38.57 v56.83,37.62 55.24,36.03 55.24,29.68 56.51,28.41 56.51,26.82 55.24,25.55 55.24,23.65 52.38,20.79 45.72,20.79 v45.08,20.15
RGBW_2  (via drill 0.61 pad 1.68)
  Top 0.61: R5.1 38.1,59.84 40.32,61.75 v40.32,62.38 | JP6.7 50.48,60.48 53.34,63.34 | v54.92,66.19 55.88,66.19 | 55.88,66.19 C5.1 | 55.88,66.19 55.88,65.88 53.34,63.34 | JP6.15 v52.7,40.16 JP7.15 JP8.15 JP10.15 JP9.4 | JP6.22 v51.43,22.38 JP7.22 JP8.22 JP10.22 | 53.34,63.34 56.19,60.48 JP7.7 JP8.7 JP10.7
  Bottom 0.61: v40.32,62.38 40.32,63.34 41.27,64.29 41.27,74.45 42.54,75.72 49.53,75.72 51.11,74.13 51.11,70 v54.92,66.19 55.24,65.88 55.24,63.02 53.34,61.11 53.34,49.37 51.43,47.46 51.43,41.43 v52.7,40.16 52.7,39.84 51.43,38.57 v51.43,22.38
RGBW_3  (via drill 0.61 pad 1.68)
  Top 0.406: 57.78,64.61 57.78,68.41 57.46,68.73 54.92,68.73 v54.61,69.05
  Top 0.61: R4.1 38.01,63.88 v39.05,64.92 | C4.1 v54.61,69.05 52.7,67.14 52.7,64.61 51.11,63.02 JP6.6 | JP6.14 v53.65,42.7 JP7.14 JP8.14 74.92,42.38 75.24,42.7 JP10.14 JP9.3 | 48.89,24.92 JP6.21 v53.34,24.92 64.45,24.92 64.77,25.23 JP7.21 JP8.21 JP10.21 90.16,24.92 | 57.78,64.61 59.37,63.02 JP7.6 JP8.6
  Bottom 0.61: v39.05,64.92 39.05,65.24 40,66.19 40,75.08 41.91,76.99 50.48,76.99 52.7,74.77 52.7,70.95 v54.61,69.05 54.92,68.73 57.46,68.73 58.41,67.78 58.41,64.29 54.61,60.48 54.61,42.7 | 54.61,42.7 v53.65,42.7 | v53.34,24.92 52.7,25.87 | 52.7,25.87 53.34,24.6 | 54.61,42.7 54.61,39.52 52.7,37.62 52.7,25.87
RGBW_4  (via drill 0.61 pad 1.68)
  Top 0.406: 67.3,72.54 66.99,72.54 66.35,71.91 61.91,71.91 60.64,70.64 55.56,70.64 54.61,71.59 v54.61,72.22
  Top 0.61: R3.1 39.68,68.73 v38.41,67.46 | C3.1 v54.61,72.22 51.11,68.1 51.11,66.83 49.84,65.56 JP6.5 | 50.16,46.19 JP6.13 v56.51,45.24 64.45,45.24 | JP6.20 54.29,27.46 | 54.29,27.46 v54.61,27.46 | JP10.5 JP8.5 JP7.5 67.94,65.56 69.53,67.14 69.53,71.59 68.57,72.54 67.3,72.54 | 64.45,45.24 JP7.13 | 64.45,45.24 JP8.13 JP10.13 JP9.2 | JP10.20 JP8.20 JP7.20 54.29,27.46
  Bottom 0.61: v38.41,67.46 38.41,75.4 41.27,78.26 51.43,78.26 54.29,75.4 54.29,71.91 v54.61,72.22 54.92,71.27 57.46,71.27 59.69,69.05 59.69,63.65 55.88,59.84 55.88,47.46 56.51,46.82 v56.51,45.24 56.51,39.52 53.97,36.98 53.97,28.09 v54.61,27.46
VDD
  Top 0.406: 29.2,76.99 28.89,76.67 28.89,75.08 28.25,74.45
  Top 0.61: JP5.2 32.7,77.14 32.7,77.62 29.84,77.62 29.2,76.99 | 28.25,74.45 28.25,69.05 25.08,65.88 IC1.14 24.76,65.88 25.08,65.56 25.08,59.84 24.76,59.52 | 17.46,54.13 18.09,53.49 D2.C 15.25,51.91 12.7,49.37 8.89,49.37 7.62,48.09 7.62,45.55 C12.+ | 17.46,54.13 16.5,55.08 15.24,55.08 13.97,53.81 10.16,53.81 | 10.16,53.81 9.84,53.81 | 24.76,59.52 24.44,59.21 21.9,59.21 19.68,56.98 19.68,56.35 17.46,54.13 | 26.35,58.57 25.71,58.57 24.76,59.52 | 26.35,58.57 C6.1 | 10.16,53.81 R18.2 | 22.08,50.14 JP2.1 | 22.08,50.14 JP3.1 22.08,54.31 26.35,58.57 | 22.08,50.14 22.22,50 | 17.46,54.13 17.62,54.29

### Text on the board
Top: Top View
Bottom: (C) Martin Wagner 2011